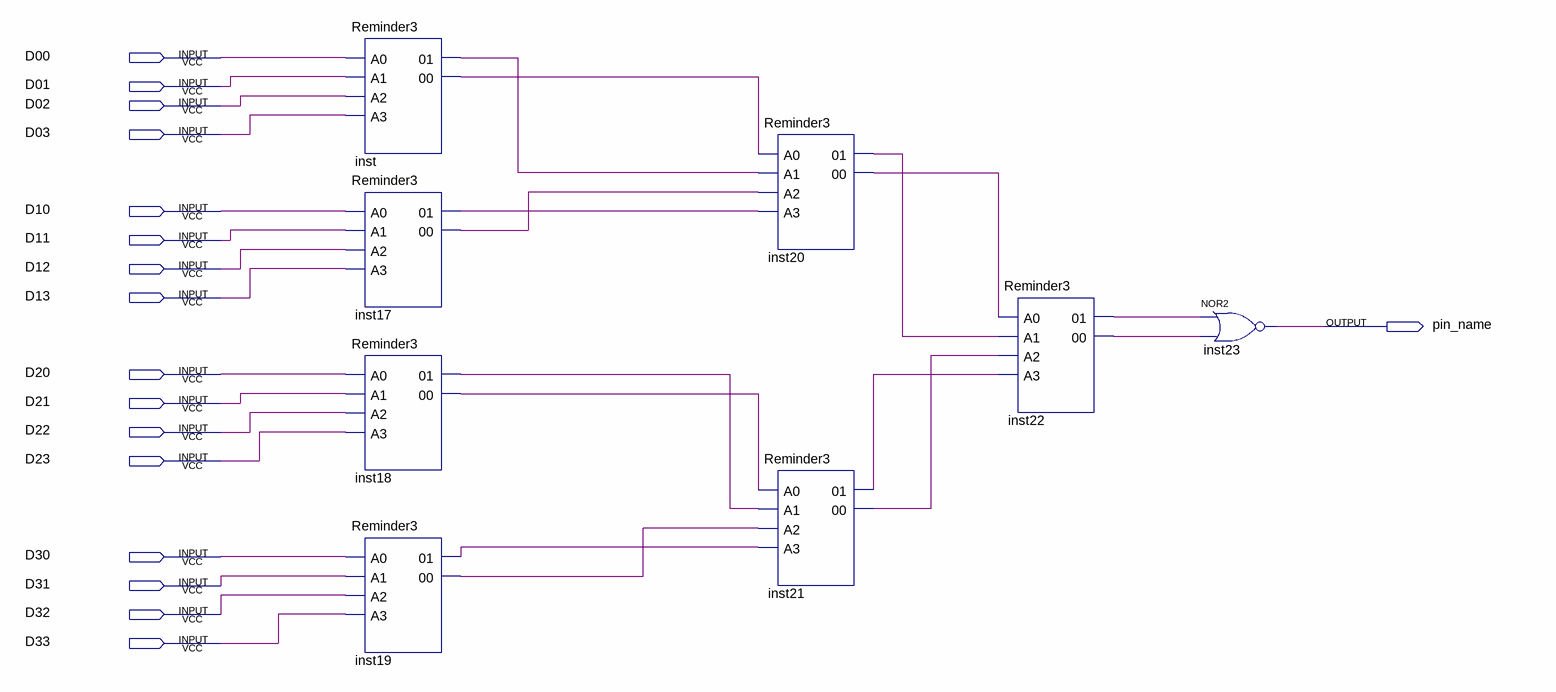
[diagram p0: schematic sheet]
// Quartus schematic DSD-1.bdf as structural Verilog: 8 symbols, 17 pins
module \DSD-1  (
  input  D00,
  input  D01,
  input  D02,
  input  D03,
  input  D10,
  input  D11,
  input  D12,
  input  D13,
  input  D20,
  input  D21,
  input  D22,
  input  D23,
  input  D30,
  input  D31,
  input  D32,
  input  D33,
  output pin_name
);

  wire inst17_00, inst17_01, inst18_00, inst18_01, inst19_00, inst19_01, inst20_00, inst20_01, inst21_00,
       inst21_01, inst22_00, inst22_01, inst_00, inst_01;

  Reminder3 inst (.A0(D00), .A1(D01), .A2(D02), .A3(D03), .\01 (inst_01), .\00 (inst_00));
  Reminder3 inst17 (.A0(D10), .A1(D11), .A2(D12), .A3(D13), .\01 (inst17_01), .\00 (inst17_00));
  Reminder3 inst18 (.A0(D20), .A1(D21), .A2(D22), .A3(D23), .\01 (inst18_01), .\00 (inst18_00));
  Reminder3 inst19 (.A0(D30), .A1(D31), .A2(D32), .A3(D33), .\01 (inst19_01), .\00 (inst19_00));
  Reminder3 inst20 (.A0(inst_00), .A1(inst_01), .A2(inst17_00), .A3(inst17_01), .\01 (inst20_01), .\00 (inst20_00));
  Reminder3 inst21 (.A0(inst18_00), .A1(inst18_01), .A2(inst19_00), .A3(inst19_01), .\01 (inst21_01), .\00 (inst21_00));
  Reminder3 inst22 (.A0(inst20_00), .A1(inst20_01), .A2(inst21_00), .A3(inst21_01), .\01 (inst22_01), .\00 (inst22_00));
  nor inst23 (pin_name, inst22_01, inst22_00);
endmodule
